# Altium project csb.PrjPCB
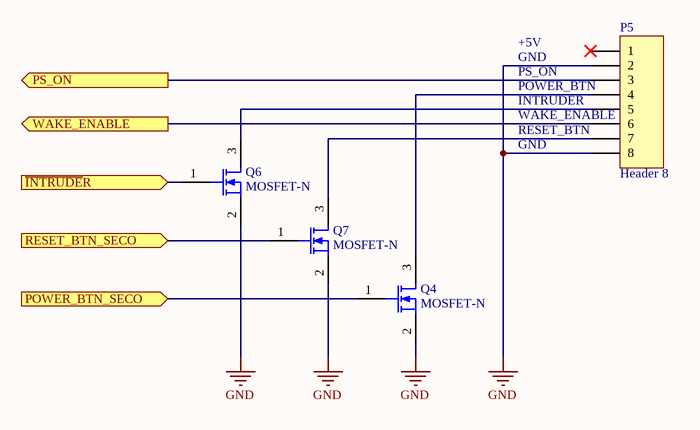
[diagram p0: SECO mobo header.SchDoc]
3 sheets, 26 parts. Net scope: hierarchical (ports join the sheet entries above them; power ports are global).
Board files: PCB1.PcbDoc, PCB2.PcbDoc
Sheets:
  SECO mobo header.SchDoc
  jtag.SchDoc
  PS2.SchDoc

## Sheet SECO mobo header.SchDoc
size A4

### Parts
P5  Header 8  [S08B-PASK-2]
Q4  MOSFET-N  [2N7002]
Q6  MOSFET-N  [2N7002]
Q7  MOSFET-N  [2N7002]

### Ports
POWER_BTN_SECO (in), PS_ON (out), RESET_BTN_SECO (in), WAKE_ENABLE (out), ~{INTRUDE}R (in)

### Nets
GND: P5.2 P5.8 Q4.2(S) Q6.2(S) Q7.2(S)
~{INTRUDE}R: Q6.1(G) ; port ~{INTRUDE}R
POWER_BTN_SECO: Q4.1(G) ; port POWER_BTN_SECO
PS_ON: P5.3 ; port PS_ON
RESET_BTN_SECO: Q7.1(G) ; port RESET_BTN_SECO
WAKE_ENABLE: P5.6 ; port WAKE_ENABLE
NetP5_4: P5.4 Q4.3(D)
NetP5_5: P5.5 Q6.3(D)
NetP5_7: P5.7 Q7.3(D)

Not connected (* = marked no-connect by the designer): P5 1*

### Notes on the sheet
- GND
- +5V
- (near P5) POWER_BTN
- (near P5) WAKE_ENABLE
- (near P5) RESET_BTN
- PS_ON
- (near P5) INTRUDER

### Library data of the parts
P5 = Header 8: Header, 8-Pin; LatestRevisionDate: 17-Jul-2002; LatestRevisionNote: Re-released for DXP Platform.; Publisher: Altium Limited; farnell: 1830753
Q4 Q6 Q7 = MOSFET-N: N-Channel MOSFET; Published: 8-Jun-2000; LatestRevisionDate: 17-Jul-2002; LatestRevisionNote: Re-released for DXP Platform.; PackageVersion: 1995/1996; PackageReference: E3; Publisher: Altium Limited; farnell: 1510761

## Sheet jtag.SchDoc
size A4
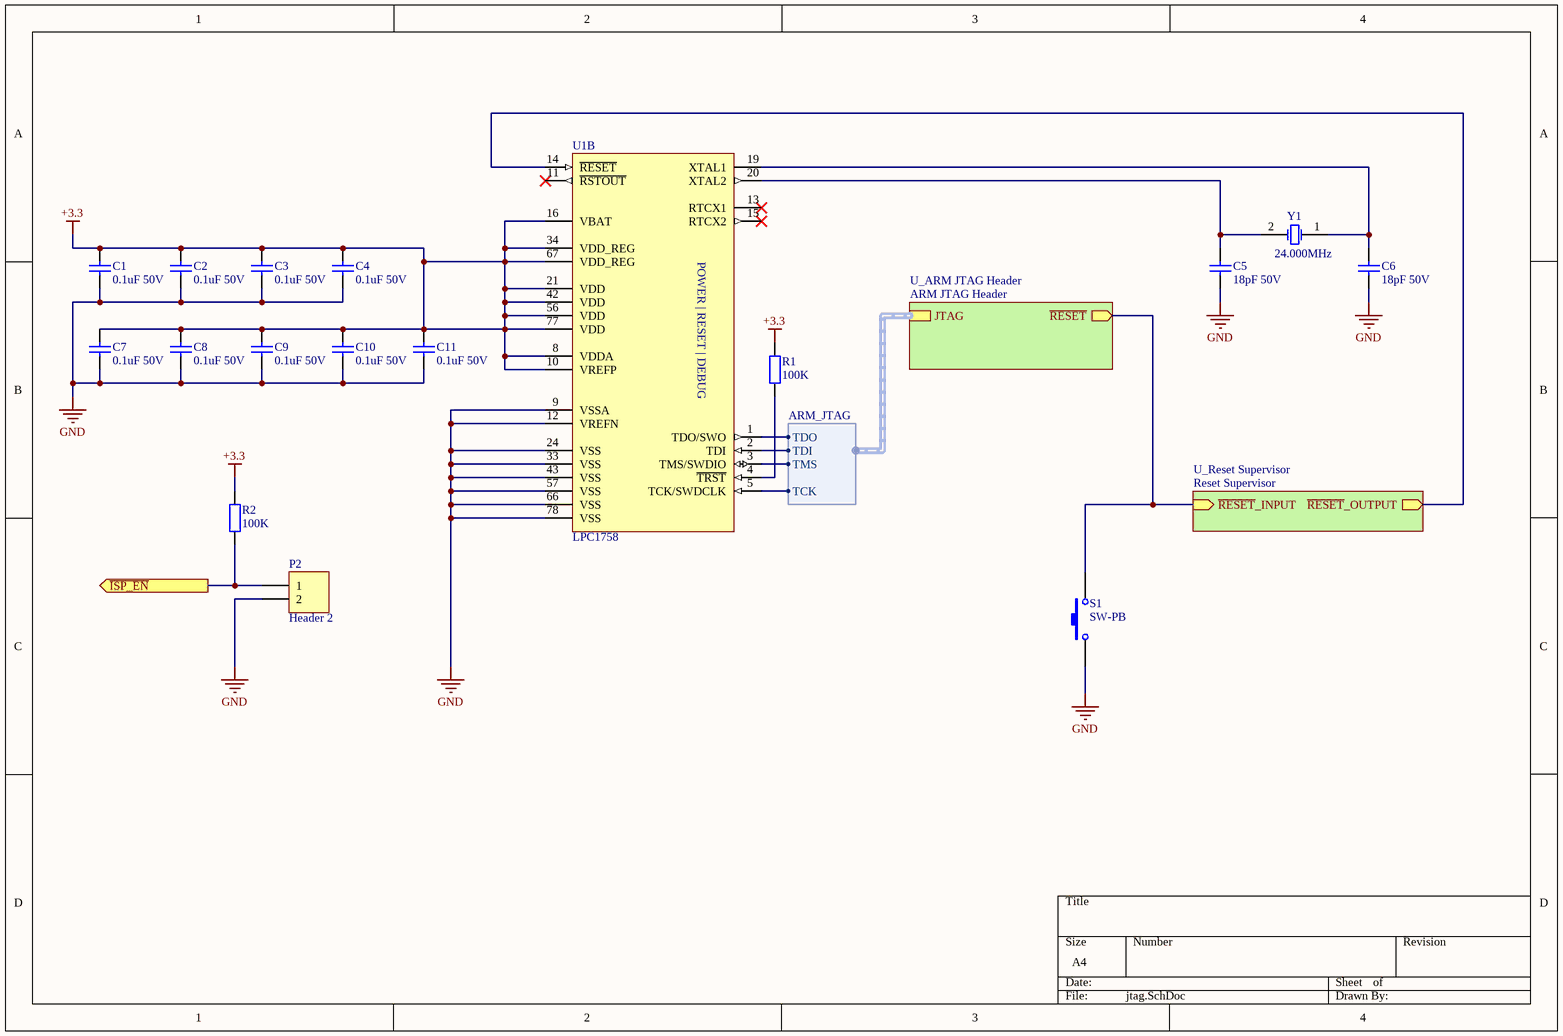
[diagram p1: jtag.SchDoc]

### Parts
C1  value 0.1uF 50V  [C0805]  (hidden comment: Cap)
C2  value 0.1uF 50V  [C0805]  (hidden comment: Cap)
C3  value 0.1uF 50V  [C0805]  (hidden comment: Cap)
C4  value 0.1uF 50V  [C0805]  (hidden comment: Cap)
C5  value 18pF 50V  [C0805]  (hidden comment: Cap)
C6  value 18pF 50V  [C0805]  (hidden comment: Cap)
C7  value 0.1uF 50V  [C0805]  (hidden comment: Cap)
C8  value 0.1uF 50V  [C0805]  (hidden comment: Cap)
C9  value 0.1uF 50V  [C0805]  (hidden comment: Cap)
C10  value 0.1uF 50V  [C0805]  (hidden comment: Cap)
C11  value 0.1uF 50V  [C0805]  (hidden comment: Cap)
P2  Header 2  [HDR1X2]
R1  value 100K  [R0603]  (hidden comment: Res)
R2  value 100K  [R0603]  (hidden comment: Res)
S1  SW-PB  [DTSM-32S-B]
U1  LPC1758  [LPC1758FBD80]  (part B of 3)
Y1  value 24.000MHz  [C3E-24.000-12-3030-X]  (hidden comment: XTAL)

### Sub-sheets
U_ARM JTAG Header = ARM JTAG Header (file not in this document): JTAG (harness ARM_JTAG), ~{RESET} (out)
U_Reset Supervisor = Reset Supervisor (file not in this document): ~{RESET}_OUTPUT (out), ~{RESET}_INPUT (in)

### Ports
~{ISP_EN} (out)

### Harnesses
ARM_JTAG: TCK, TDI, TDO, TMS

### Nets
+3.3: C1.1 C2.1 C3.1 C4.1 C7.1 C8.1 C9.1 C10.1 C11.1 R1.2 R2.2 U1.8(VDDA) U1.10(VREFP) U1.16(VBAT) U1.21(VDD) U1.34(VDD_REG) U1.42(VDD) U1.56(VDD) U1.67(VDD_REG) U1.77(VDD)
GND: C1.2 C2.2 C3.2 C4.2 C5.2 C6.2 C7.2 C8.2 C9.2 C10.2 C11.2 P2.2 S1.1 U1.9(VSSA) U1.12(VREFN) U1.24(VSS) U1.33(VSS) U1.43(VSS) U1.57(VSS) U1.66(VSS) U1.78(VSS)
~{ISP_EN}: P2.1 R2.1 ; port ~{ISP_EN}
NetC5_1: C5.1 U1.20(XTAL2) Y1.2(OSC2)
NetC6_1: C6.1 U1.19(XTAL1) Y1.1(OSC1)
NetR1_1: R1.1 U1.4(~{TRST})
NetS1_2: S1.2 ; sheet U_ARM JTAG Header/~{RESET}, sheet U_Reset Supervisor/~{RESET}_INPUT
NetU1_1: U1.1(TDO/SWO) ; sheet U_ARM JTAG Header/JTAG.TDO
NetU1_2: U1.2(TDI) ; sheet U_ARM JTAG Header/JTAG.TDI
NetU1_3: U1.3(TMS/SWDIO) ; sheet U_ARM JTAG Header/JTAG.TMS
NetU1_5: U1.5(TCK/SWDCLK) ; sheet U_ARM JTAG Header/JTAG.TCK
NetU1_14: U1.14(~{RESET}) ; sheet U_Reset Supervisor/~{RESET}_OUTPUT

Not connected (* = marked no-connect by the designer): U1 11(~{RSTOUT})* 13(RTCX1)* 15(RTCX2)*

### Notes on the sheet
- (in symbol LPC1758, part B) POWER | RESET | DEBUG

### Library data of the parts
C1-C11 = Cap: Capacitor
  C1-C4 C7-C11: farnell: 1414664
  C5 C6: farnell: 1414673
P2 = Header 2: Header, 2-Pin; LatestRevisionDate: 17-Jul-2002; LatestRevisionNote: Re-released for DXP Platform.; Publisher: Altium Limited
R1 R2 = Res2: Resistor; farnell: 9330402
S1 = SW-PB: Switch; Published: 24-Mar-1999; LatestRevisionDate: 17-Jul-2002; LatestRevisionNote: Re-released for DXP Platform.; PackageReference: SPST-2; Publisher: Altium Limited; farnell: 9471898
U1 = LPC1758: NXP - LPC1758FBD80 - MCU, 32BIT, ARM CORTEX M3, 80LQFP; farnell: 1718545
Y1 = XTAL: Crystal Oscillator; farnell: 1538861

## Sheet PS2.SchDoc
size A4
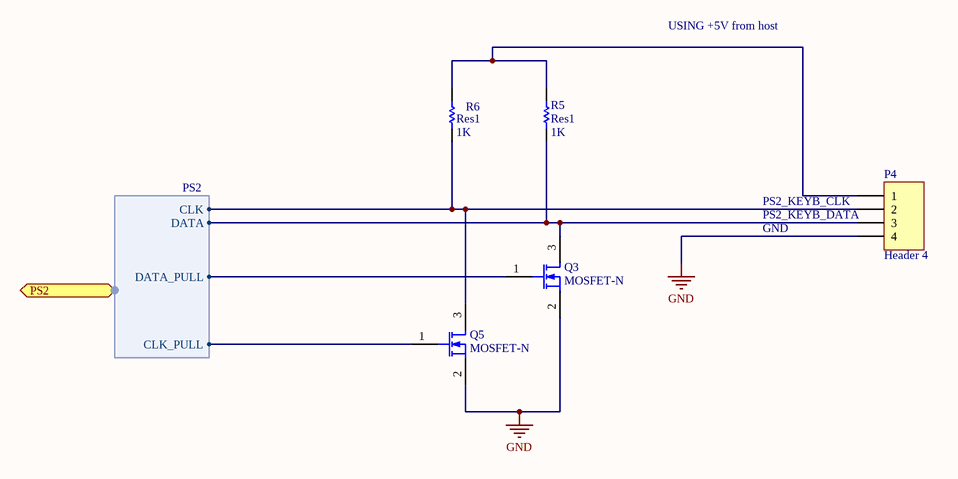
[diagram p2: PS2.SchDoc]

### Parts
P4  Header 4  [S04B-PASK-2]
Q3  MOSFET-N  [2N7002]
Q5  MOSFET-N  [2N7002]
R5  Res1  value 1K  [R0603]
R6  Res1  value 1K  [R0603]

### Ports
PS2 (harness PS2)

### Harnesses
PS2: CLK, DATA, DATA_PULL, CLK_PULL

### Nets
GND: P4.4 Q3.2(S) Q5.2(S)
NetP4_1: P4.1 R5.2 R6.2
NetP4_2: P4.2 Q5.3(D) R6.1 ; port PS2.CLK
NetP4_3: P4.3 Q3.3(D) R5.1 ; port PS2.DATA
NetQ3_1: Q3.1(G) ; port PS2.DATA_PULL
NetQ5_1: Q5.1(G) ; port PS2.CLK_PULL

### Notes on the sheet
- USING +5V from host
- (near P4) PS2_KEYB_CLK
- (near P4) PS2_KEYB_DATA
- GND

### Library data of the parts
P4 = Header 4: Header, 4-Pin; LatestRevisionDate: 17-Jul-2002; LatestRevisionNote: Re-released for DXP Platform.; Publisher: Altium Limited; farnell: 1830749
Q3 Q5 = MOSFET-N: N-Channel MOSFET; Published: 8-Jun-2000; LatestRevisionDate: 17-Jul-2002; LatestRevisionNote: Re-released for DXP Platform.; PackageVersion: 1995/1996; PackageReference: E3; Publisher: Altium Limited; farnell: 1510761
R5 R6 = Res1: Resistor; Published: 8-Jun-2000; LatestRevisionDate: 17-Jul-2002; LatestRevisionNote: Re-released for DXP Platform.; PackageReference: AXIAL-0.3; Publisher: Altium Limited; farnell: 9330402

## Nets that join several sheets
GND: SECO mobo header (5 pins), jtag (21 pins), PS2 (P4.4 Q3.2 Q5.2)